# Altium schematic sheet RXTX_IF_Complete.SchDoc
size B
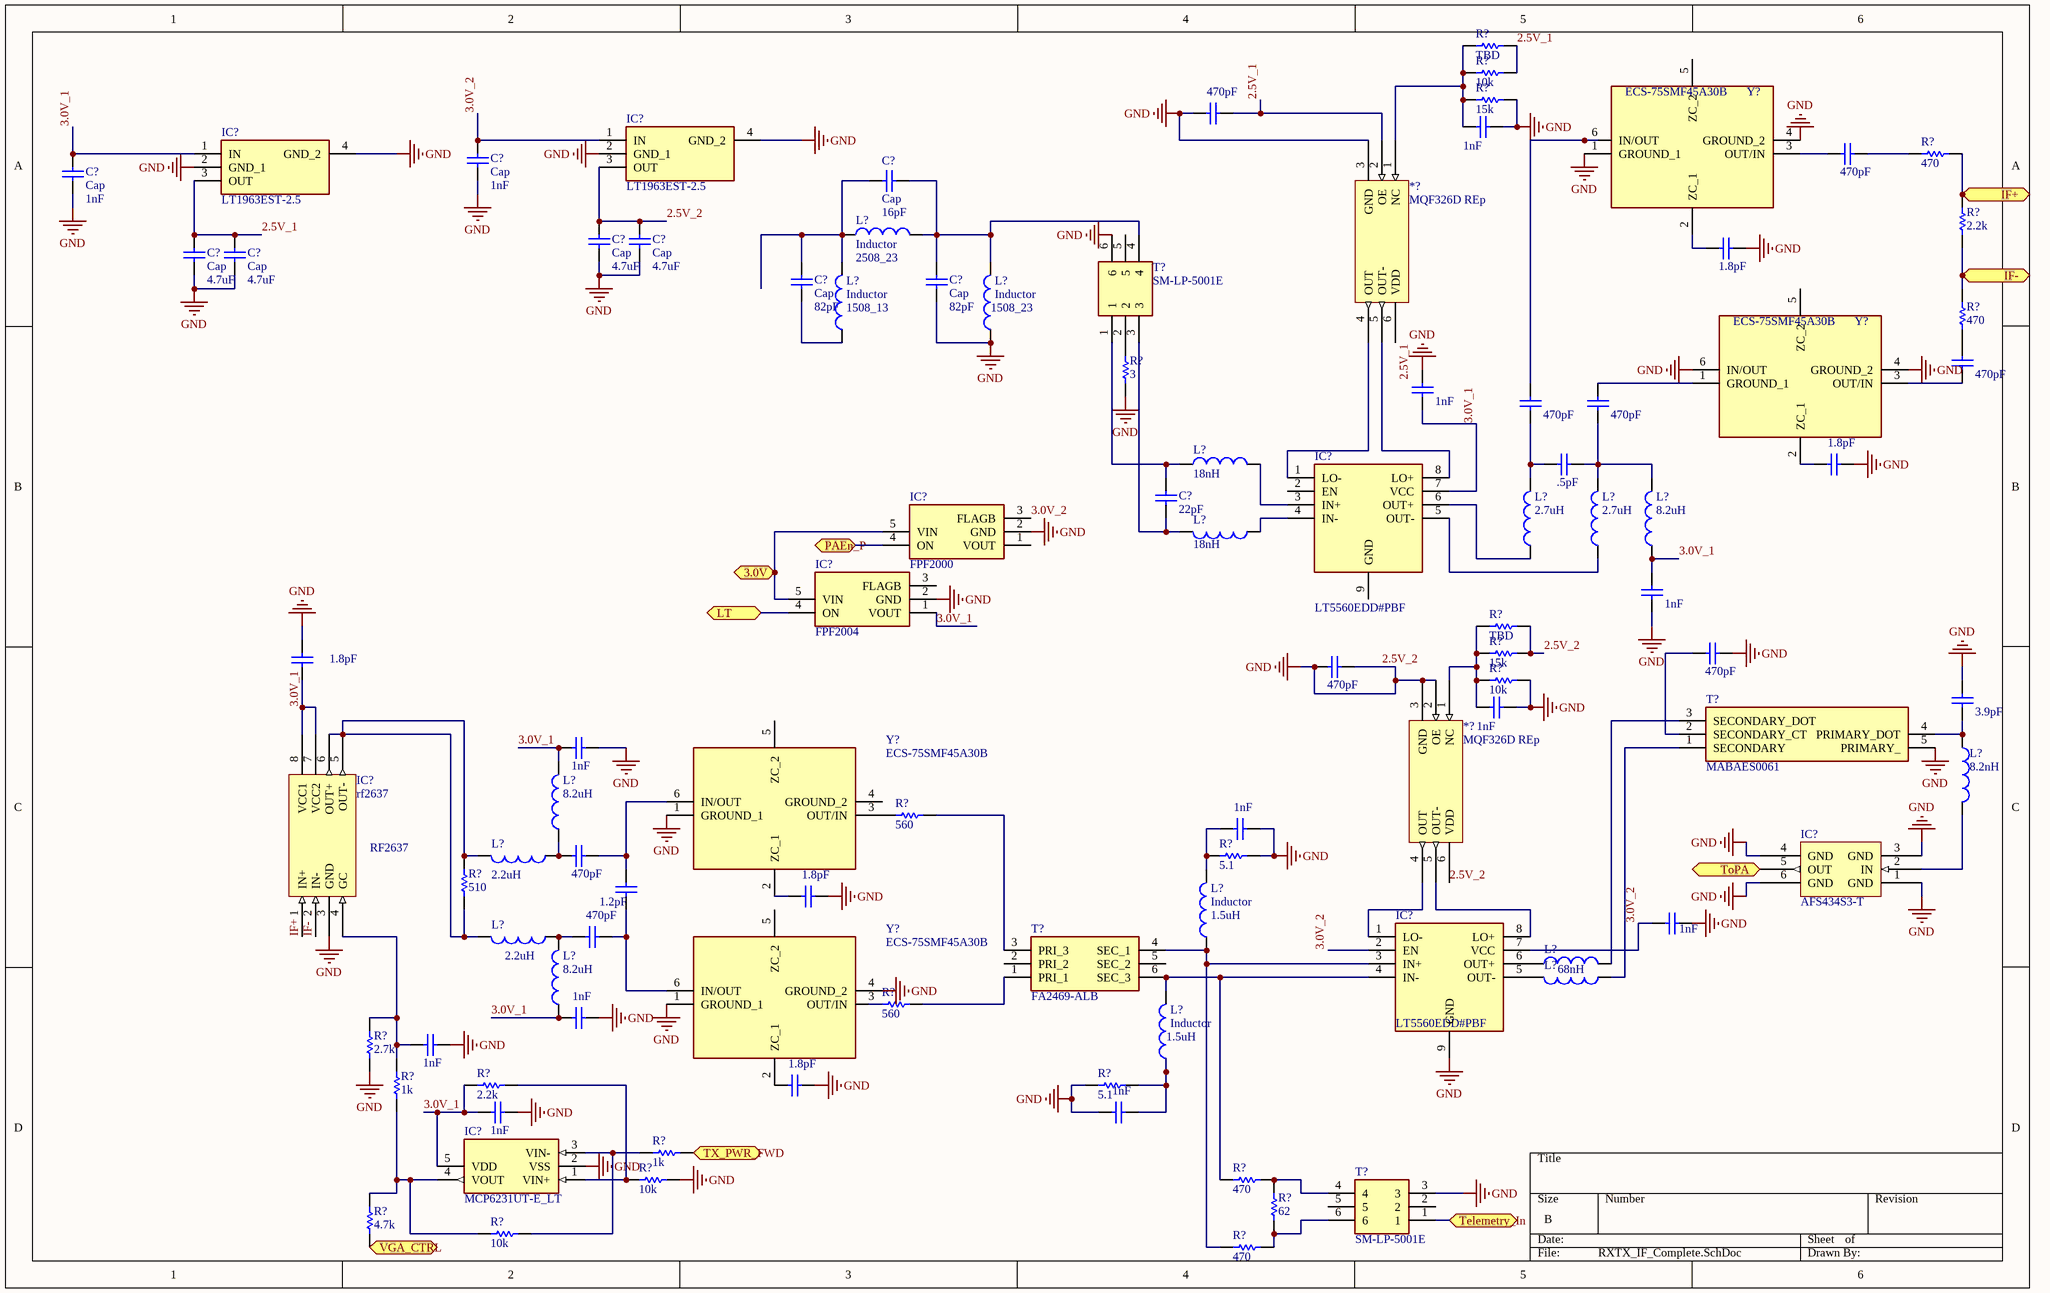
[diagram p0: RXTX_IF_Complete.SchDoc]

## Parts
(Parts that share a designator on the sheet are numbered #1, #2 ... from top to bottom, then left to right.)
*?#1  MQF326D REp  [MQF326D]
*?#2  MQF326D REp  [MQF326D]
C?#1  value 470pF  [0603]  (hidden comment: Cap)
C?#2  value 1nF  [0603]  (hidden comment: Cap)
C?#3  Cap  value 1nF  [0603]
C?#4  value 470pF  [0603]  (hidden comment: Cap)
C?#5  Cap  value 1nF  [0603]
C?#6  Cap  value 16pF  [0603]
C?#7  Cap  value 4.7uF  [0603]
C?#8  Cap  value 4.7uF  [0603]
C?#9  Cap  value 4.7uF  [0603]
C?#10  Cap  value 4.7uF  [0603]
C?#11  value 1.8pF  [0603]  (hidden comment: Cap)
C?#12  Cap  value 82pF  [0603]
C?#13  Cap  value 82pF  [0603]
C?#14  value 470pF  [0603]  (hidden comment: Cap)
C?#15  value 1nF  [0603]  (hidden comment: Cap)
C?#16  value 470pF  [0603]  (hidden comment: Cap)
C?#17  value 470pF  [0603]  (hidden comment: Cap)
C?#18  value .5pF  [0603]  (hidden comment: Cap)
C?#19  value 1.8pF  [0603]  (hidden comment: Cap)
C?#20  value 22pF  [0603]  (hidden comment: Cap)
C?#21  value 1nF  [0603]  (hidden comment: Cap)
C?#22  value 470pF  [0603]  (hidden comment: Cap)
C?#23  value 1.8pF  [0603]  (hidden comment: Cap)
C?#24  value 470pF  [0603]  (hidden comment: Cap)
C?#25  value 3.9pF  [0603]  (hidden comment: Cap)
C?#26  value 1nF  [0603]  (hidden comment: Cap)
C?#27  value 1nF  [0603]  (hidden comment: Cap)
C?#28  value 1nF  [0603]  (hidden comment: Cap)
C?#29  value 470pF  [0603]  (hidden comment: Cap)
C?#30  value 1.2pF  [0603]  (hidden comment: Cap)
C?#31  value 1.8pF  [0603]  (hidden comment: Cap)
C?#32  value 1nF  [0603]  (hidden comment: Cap)
C?#33  value 470pF  [0603]  (hidden comment: Cap)
C?#34  value 1nF  [0603]  (hidden comment: Cap)
C?#35  value 1nF  [0603]  (hidden comment: Cap)
C?#36  value 1nF  [0603]  (hidden comment: Cap)
C?#37  value 1.8pF  [0603]  (hidden comment: Cap)
C?#38  value 1nF  [0603]  (hidden comment: Cap)
IC?#1  LT1963EST-2.5  [SOT230P700X180-4N]
IC?#2  LT1963EST-2.5  [SOT230P700X180-4N]
IC?#3  LT5560EDD#PBF  [SON50P300X300X80-9N-D]
IC?#4  FPF2000  [SOT65P210X110-5N]
IC?#5  FPF2004  [SOT65P210X110-5N]
IC?#6  AFS434S3-T  [AFS434S3]
IC?#7  rf2637  [RF2637]
IC?#8  LT5560EDD#PBF  [SON50P300X300X80-9N-D]
IC?#9  MCP6231UT-E_LT  [SOT65P210X110-5N]
L?#1  Inductor  value 2508_23  [0603]
L?#2  Inductor  value 1508_13  [0603]
L?#3  Inductor  value 1508_23  [0603]
L?#4  value 18nH  [0603]  (hidden comment: Inductor)
L?#5  value 18nH  [0603]  (hidden comment: Inductor)
L?#6  value 2.7uH  [0603]  (hidden comment: Inductor)
L?#7  value 2.7uH  [0603]  (hidden comment: Inductor)
L?#8  value 8.2uH  [0603]  (hidden comment: Inductor)
L?#9  value 8.2nH  [0603]  (hidden comment: Inductor)
L?#10  value 8.2uH  [0603]  (hidden comment: Inductor)
L?#11  value 2.2uH  [0603]  (hidden comment: Inductor)
L?#12  Inductor  value 1.5uH  [0603]
L?#13  value 2.2uH  [0603]  (hidden comment: Inductor)
L?#14  value 68nH  [0603]  (hidden comment: Inductor)
L?#15  Inductor  [0603]  (value not drawn)
L?#16  value 8.2uH  [0603]  (hidden comment: Inductor)
L?#17  Inductor  value 1.5uH  [0603]
R?#1  value TBD  [0603]  (hidden comment: Res1)
R?#2  value 10k  [0603]  (hidden comment: Res1)
R?#3  value 15k  [0603]  (hidden comment: Res1)
R?#4  value 470  [0603]  (hidden comment: Res1)
R?#5  value 2.2k  [0603]  (hidden comment: Res1)
R?#6  value 470  [0603]  (hidden comment: Res1)
R?#7  value 3  [0603]  (hidden comment: Res1)
R?#8  value TBD  [0603]  (hidden comment: Res1)
R?#9  value 15k  [0603]  (hidden comment: Res1)
R?#10  value 10k  [0603]  (hidden comment: Res1)
R?#11  value 560  [0603]  (hidden comment: Res1)
R?#12  value 510  [0603]  (hidden comment: Res1)
R?#13  value 5.1  [0603]  (hidden comment: Res1)
R?#14  value 560  [0603]  (hidden comment: Res1)
R?#15  value 2.7k  [0603]  (hidden comment: Res1)
R?#16  value 1k  [0603]  (hidden comment: Res1)
R?#17  value 2.2k  [0603]  (hidden comment: Res1)
R?#18  value 5.1  [0603]  (hidden comment: Res1)
R?#19  value 1k  [0603]  (hidden comment: Res1)
R?#20  value 10k  [0603]  (hidden comment: Res1)
R?#21  value 470  [0603]  (hidden comment: Res1)
R?#22  value 62  [0603]  (hidden comment: Res1)
R?#23  value 4.7k  [0603]  (hidden comment: Res1)
R?#24  value 10k  [0603]  (hidden comment: Res1)
R?#25  value 470  [0603]  (hidden comment: Res1)
T?#1  SM-LP-5001E  [SMLP5001E]
T?#2  MABAES0061  [MABAES0061]
T?#3  FA2469-ALB  [FA2469ALB]
T?#4  SM-LP-5001E  [SMLP5001E]
Y?#1  ECS-75SMF45A30B  [ECS75SMF45A30B]
Y?#2  ECS-75SMF45A30B  [ECS75SMF45A30B]
Y?#3  ECS-75SMF45A30B  [ECS75SMF45A30B]
Y?#4  ECS-75SMF45A30B  [ECS75SMF45A30B]

## Ports
3.0V (bidir), IF+ (bidir), IF- (bidir), LT (bidir), PAEn_P (bidir), Telemetry_In (bidir), ToPA (bidir), TX_PWR_FWD (bidir), VGA_CTRL (bidir)

## Nets
2.5V_2: *?#1.3(GND) *?#2.2(OE) *?#2.3(GND) *?#2.6(VDD) C?#1.2 C?#2.1 C?#3.1 C?#5.1 C?#7.1 C?#7.2 C?#8.1 C?#8.2 C?#9.1 C?#10.1 C?#11.1 C?#13.2 C?#15.1 C?#19.1 C?#21.1 C?#22.2 C?#23.1 C?#24.1 C?#24.2 C?#25.1 C?#26.1 C?#27.1 C?#28.1 C?#31.1 C?#32.1 C?#34.2 C?#35.1 C?#36.2 C?#37.1 C?#38.2 IC?#1.2(GND_1) IC?#1.3(OUT) IC?#1.4(GND_2) IC?#2.2(GND_1) IC?#2.4(GND_2) IC?#4.2(GND) IC?#5.2(GND) IC?#6.1(GND) IC?#6.3(GND) IC?#6.4(GND) IC?#6.6(GND) IC?#7.3(GND) IC?#8.9(GND) IC?#9.2(VSS) L?#3.1 R?#3.1 R?#7.1 R?#8.1 R?#9.1 R?#10.1 R?#13.1 R?#15.2 R?#18.2 R?#20.2 T?#1.6 T?#2.5(PRIMARY_) T?#4.3 Y?#1.1(GROUND_1) Y?#1.4(GROUND_2) Y?#2.4(GROUND_2) Y?#2.6(IN/OUT) Y?#3.1(GROUND_1) Y?#4.1(GROUND_1) Y?#4.4(GROUND_2)  [also labelled GND]
2.5V_1: *?#1.2(OE) *?#1.6(VDD) C?#1.1 C?#9.2 C?#10.2 IC?#2.3(OUT) R?#1.1 R?#2.1
3.0V: IC?#4.5(VIN) IC?#5.5(VIN) ; port 3.0V
3.0V_1: C?#5.2 C?#15.2 C?#21.2 C?#23.2 C?#27.2 C?#35.2 C?#36.1 IC?#2.1(IN) IC?#3.7(VCC) IC?#5.1(VOUT) IC?#7.7(VCC2) IC?#7.8(VCC1) IC?#9.5(VDD) L?#8.1 L?#10.2 L?#16.1 R?#17.1
3.0V_2: C?#3.2 C?#32.2 IC?#1.1(IN) IC?#4.3(FLAGB) IC?#8.2(EN) IC?#8.7(VCC)
IF+: R?#4.1 R?#5.1 ; port IF+
IF+: IC?#7.1(IN+)  [a separate net that carries the same name]
IF-: R?#5.2 R?#6.1 ; port IF-
IF-: IC?#7.2(IN-)  [a separate net that carries the same name]
LT: IC?#5.4(ON) ; port LT
PAEn_P: IC?#4.4(ON) ; port PAEn_P
Telemetry_In: T?#4.1 ; port Telemetry_In
ToPA: IC?#6.5(OUT) ; port ToPA
TX_PWR_FWD: R?#19.2 ; port TX_PWR_FWD
VGA_CTRL: R?#23.2 ; port VGA_CTRL
Net*?#1_1: *?#1.1(NC) C?#2.2 R?#1.2 R?#2.2 R?#3.2
Net*?#1_4: *?#1.4(OUT) IC?#3.1(LO-)
Net*?#1_5: *?#1.5(OUT-) IC?#3.8(LO+)
Net*?#2_1: *?#2.1(NC) C?#26.2 R?#8.2 R?#9.2 R?#10.2
Net*?#2_4: *?#2.4(OUT) IC?#8.1(LO-)
Net*?#2_5: *?#2.5(OUT-) IC?#8.8(LO+)
NetC?#4_1: C?#4.1 R?#4.2
NetC?#4_2: C?#4.2 Y?#1.3(OUT/IN)
NetC?#6_1: C?#6.1 C?#13.1 L?#1.2 L?#3.2 T?#1.4
NetC?#6_2: C?#6.2 C?#12.1 L?#1.1 L?#2.2
NetC?#11_2: C?#11.2 Y?#1.2(ZC_1)
NetC?#12_2: C?#12.2 L?#2.1
NetC?#14_1: C?#14.1 Y?#2.3(OUT/IN)
NetC?#14_2: C?#14.2 R?#6.2
NetC?#16_1: C?#16.1 C?#18.2 L?#6.2
NetC?#16_2: C?#16.2 Y?#1.6(IN/OUT)
NetC?#17_1: C?#17.1 C?#18.1 L?#7.2 L?#8.2
NetC?#17_2: C?#17.2 Y?#2.1(GROUND_1)
NetC?#19_2: C?#19.2 Y?#2.2(ZC_1)
NetC?#20_1: C?#20.1 L?#4.1 T?#1.1
NetC?#20_2: C?#20.2 L?#5.2 T?#1.3
NetC?#22_1: C?#22.1 T?#2.2(SECONDARY_CT)
NetC?#25_2: C?#25.2 L?#9.1 T?#2.4(PRIMARY_DOT)
NetC?#28_2: C?#28.2 L?#12.2 R?#13.2
NetC?#29_1: C?#29.1 C?#30.1 Y?#3.6(IN/OUT)
NetC?#29_2: C?#29.2 L?#10.1 L?#11.1
NetC?#30_2: C?#30.2 C?#33.1 Y?#4.6(IN/OUT)
NetC?#31_2: C?#31.2 Y?#3.2(ZC_1)
NetC?#33_2: C?#33.2 L?#13.1 L?#16.2
NetC?#34_1: C?#34.1 IC?#7.4(GC) R?#15.1 R?#16.1
NetC?#37_2: C?#37.2 Y?#4.2(ZC_1)
NetC?#38_1: C?#38.1 L?#17.1 R?#18.1
NetIC?#3_3: IC?#3.3(IN+) L?#4.2
NetIC?#3_4: IC?#3.4(IN-) L?#5.1
NetIC?#3_5: IC?#3.5(OUT-) L?#7.1
NetIC?#3_6: IC?#3.6(OUT+) L?#6.1
NetIC?#6_2: IC?#6.2(IN) L?#9.2
NetIC?#7_5: IC?#7.5(OUT-) IC?#7.6(OUT+) L?#11.2 L?#13.2 R?#12.1 R?#12.2
NetIC?#8_3: IC?#8.3(IN+) L?#12.1 R?#25.2 T?#3.4(SEC_1)
NetIC?#8_4: IC?#8.4(IN-) L?#17.2 R?#21.2 T?#3.6(SEC_3)
NetIC?#8_5: IC?#8.5(OUT-) L?#15.2
NetIC?#8_6: IC?#8.6(OUT+) L?#14.1
NetIC?#9_1: IC?#9.1(VIN+) R?#17.2 R?#20.1
NetIC?#9_3: IC?#9.3(VIN-) R?#19.1 R?#24.2
NetIC?#9_4: IC?#9.4(VOUT) R?#16.2 R?#23.1 R?#24.1
NetL?#14_2: L?#14.2 T?#2.3(SECONDARY_DOT)
NetL?#15_1: L?#15.1 T?#2.1(SECONDARY)
NetR?#7_2: R?#7.2 T?#1.2
NetR?#11_1: R?#11.1 T?#3.3(PRI_3)
NetR?#11_2: R?#11.2 Y?#3.3(OUT/IN)
NetR?#14_1: R?#14.1 T?#3.1(PRI_1)
NetR?#14_2: R?#14.2 Y?#4.3(OUT/IN)
NetR?#21_1: R?#21.1 R?#22.1 T?#4.4
NetR?#22_2: R?#22.2 R?#25.1 T?#4.6

Not connected (* = marked no-connect by the designer): IC?#3 2(EN) 9(GND); IC?#4 1(VOUT); IC?#5 3(FLAGB); T?#1 5; T?#3 2(PRI_2) 5(SEC_2); T?#4 2 5; Y?#1 5(ZC_2); Y?#2 5(ZC_2); Y?#3 4(GROUND_2) 5(ZC_2); Y?#4 5(ZC_2)

## Notes on the sheet
- (near IC?#7) RF2637

## Library data of the parts
*?#1 *?#2 IC?#6 IC?#7 = Component_1
C?#1-C?#38 = Cap: Capacitor; Published: 8-Jun-2000; LatestRevisionDate: 17-Jul-2002; LatestRevisionNote: Re-released for DXP Platform.; PackageReference: RAD-0.3; Publisher: Altium Limited; PackageDescription: Radial Cap, Thru-Hole; 2 Leads; 0.3 in Pin Spacing
IC?#1 IC?#2 = LT1963EST-2.5: Integrated Circuit; Manufacturer_Name: Linear Technology; Datasheet Link: https://www.mouser.com/datasheet/2/609/1963fc-1270290.pdf; Height: 1.8mm; Manufacturer_Part_Number: LT1963EST-2.5; Mouser Part Number: 584-LT1963EST-2.5; Mouser Price/Stock: https://www.mouser.com/Search/Refine.aspx?Keyword=584-LT1963EST-2.5
IC?#3 IC?#8 = LT5560EDD#PBF: Integrated Circuit; Manufacturer_Name: Linear Technology; Datasheet Link: https://www.analog.com/media/en/technical-documentation/data-sheets/5560f.pdf; Height: 0.8mm; Manufacturer_Part_Number: LT5560EDD#PBF; Mouser Part Number: 584-LT5560EDD#PBF; Mouser Price/Stock: https://www.mouser.com/Search/Refine.aspx?Keyword=584-LT5560EDD%23PBF; RS Part Number: 7869705; RS Price/Stock: https://uk.rs-online.com/web/p/products/7869705
IC?#4 = FPF2000: Integrated Circuit; Manufacturer_Name: ON Semiconductor; Datasheet Link: https://www.onsemi.com/pub/Collateral/FPF2001-D.pdf; Height: 1.1mm; Manufacturer_Part_Number: FPF2000; Mouser Part Number: 512-FPF2000; Mouser Price/Stock: https://www.mouser.com/Search/Refine.aspx?Keyword=512-FPF2000; RS Part Number: 6709942P; RS Price/Stock: http://uk.rs-online.com/web/p/products/6709942P
IC?#5 = FPF2004: Integrated Circuit; Manufacturer_Name: ON Semiconductor; Datasheet Link: https://www.onsemi.com/pub/Collateral/FPF2001-D.pdf; Height: 1.1mm; Manufacturer_Part_Number: FPF2004; Mouser Part Number: 512-FPF2004; Mouser Price/Stock: https://www.mouser.com/Search/Refine.aspx?Keyword=512-FPF2004; RS Part Number: 8088916P; RS Price/Stock: http://uk.rs-online.com/web/p/products/8088916P
IC?#9 = MCP6231UT-E_LT: Integrated Circuit; Manufacturer_Name: Microchip; Manufacturer_Part_Number: MCP6231UT-E/LT; Allied_Number: 70414866; Datasheet Link: http://ww1.microchip.com/downloads/en/DeviceDoc/21881e.pdf; Height: 1.1mm; Mouser Part Number: 579-MCP6231UT-E/LT; Mouser Price/Stock: https://www.mouser.com/Search/Refine.aspx?Keyword=579-MCP6231UT-E%2FLT; RS Part Number: 7240643P; RS Price/Stock: http://uk.rs-online.com/web/p/products/7240643P; Allied Price/Stock: http://www.alliedelec.com/microchip-technology-inc-mcp6231ut-e-lt/70414866/
L?#1-L?#17 = Inductor: Code_IEC: 1005; Published: 8-Jun-2000; LatestRevisionDate: 29-May-2009; LatestRevisionNote: IPC-7351 Footprint Added.; PackageReference: 0402-A; Publisher: Altium Limited; PackageDescription: Chip Inductor; Code_JEITA: 0402
R?#1-R?#25 = Res1: Resistor; Published: 8-Jun-2000; LatestRevisionDate: 17-Jul-2002; LatestRevisionNote: Re-released for DXP Platform.; PackageReference: AXIAL-0.3; Publisher: Altium Limited; PackageDescription: Axial Device, Thru-Hole; 2 Leads; 0.3 in Pin Spacing
T?#1 = SM-LP-5001E: Transformer; Manufacturer_Name: Bourns; Allied_Number: 70155232; Datasheet Link: https://www.bourns.com/pdfs/SMLP5001.pdf; Height: 7mm; Manufacturer_Part_Number: SM-LP-5001E; Mouser Part Number: 652-SM-LP-5001E; Mouser Price/Stock: https://www.mouser.com/Search/Refine.aspx?Keyword=652-SM-LP-5001E; RS Part Number: 1728670; RS Price/Stock: https://uk.rs-online.com/web/p/products/1728670; Allied Price/Stock: https://www.alliedelec.com/bourns-sm-lp-5001e/70155232/
T?#2 = MABAES0061: Transformer; Manufacturer_Name: MACOM; Datasheet Link: https://componentsearchengine.com/Datasheets/1/MABAES0061.pdf; Height: 0.64mm; Manufacturer_Part_Number: MABAES0061; Mouser Part Number: 937-MABAES0061; Mouser Price/Stock: https://www.mouser.com/Search/Refine.aspx?Keyword=937-MABAES0061
T?#3 = FA2469-ALB: Transformer; Manufacturer_Name: COILCRAFT; Datasheet Link: https://www.mouser.com/datasheet/2/597/fa2469-463452.pdf; Height: 9.02mm; Manufacturer_Part_Number: FA2469-ALB; Mouser Part Number: 994-FA2469-ALB; Mouser Price/Stock: https://www.mouser.com/Search/Refine.aspx?Keyword=994-FA2469-ALB
T?#4 = SM-LP-5001E: 1:1 Transformer; Manufacturer_Name: Bourns; Allied_Number: 70155232; Datasheet Link: https://www.bourns.com/pdfs/SMLP5001.pdf; Height: 7mm; Manufacturer_Part_Number: SM-LP-5001E; Mouser Part Number: 652-SM-LP-5001E; Mouser Price/Stock: https://www.mouser.com/Search/Refine.aspx?Keyword=652-SM-LP-5001E; RS Part Number: 1728670; RS Price/Stock: https://uk.rs-online.com/web/p/products/1728670; Allied Price/Stock: https://www.alliedelec.com/bourns-sm-lp-5001e/70155232/
Y?#1-Y?#4 = ECS-75SMF45A30B: Crystal or Oscillator; Manufacturer_Name: ECS; Datasheet Link: https://www.mouser.com/datasheet/2/122/ECS_75SMF-10007.pdf; Height: 0.95mm; Manufacturer_Part_Number: ECS-75SMF45A30B; Mouser Part Number: 520-ECS-75SMF45A30B; Mouser Price/Stock: https://www.mouser.com/Search/Refine.aspx?Keyword=520-ECS-75SMF45A30B